# Altium schematic sheet amplifier.SchDoc: Class D Amplifier
size A2; Author: Harsha Sandirigama; DrawnBy: Harsha Sandirigama
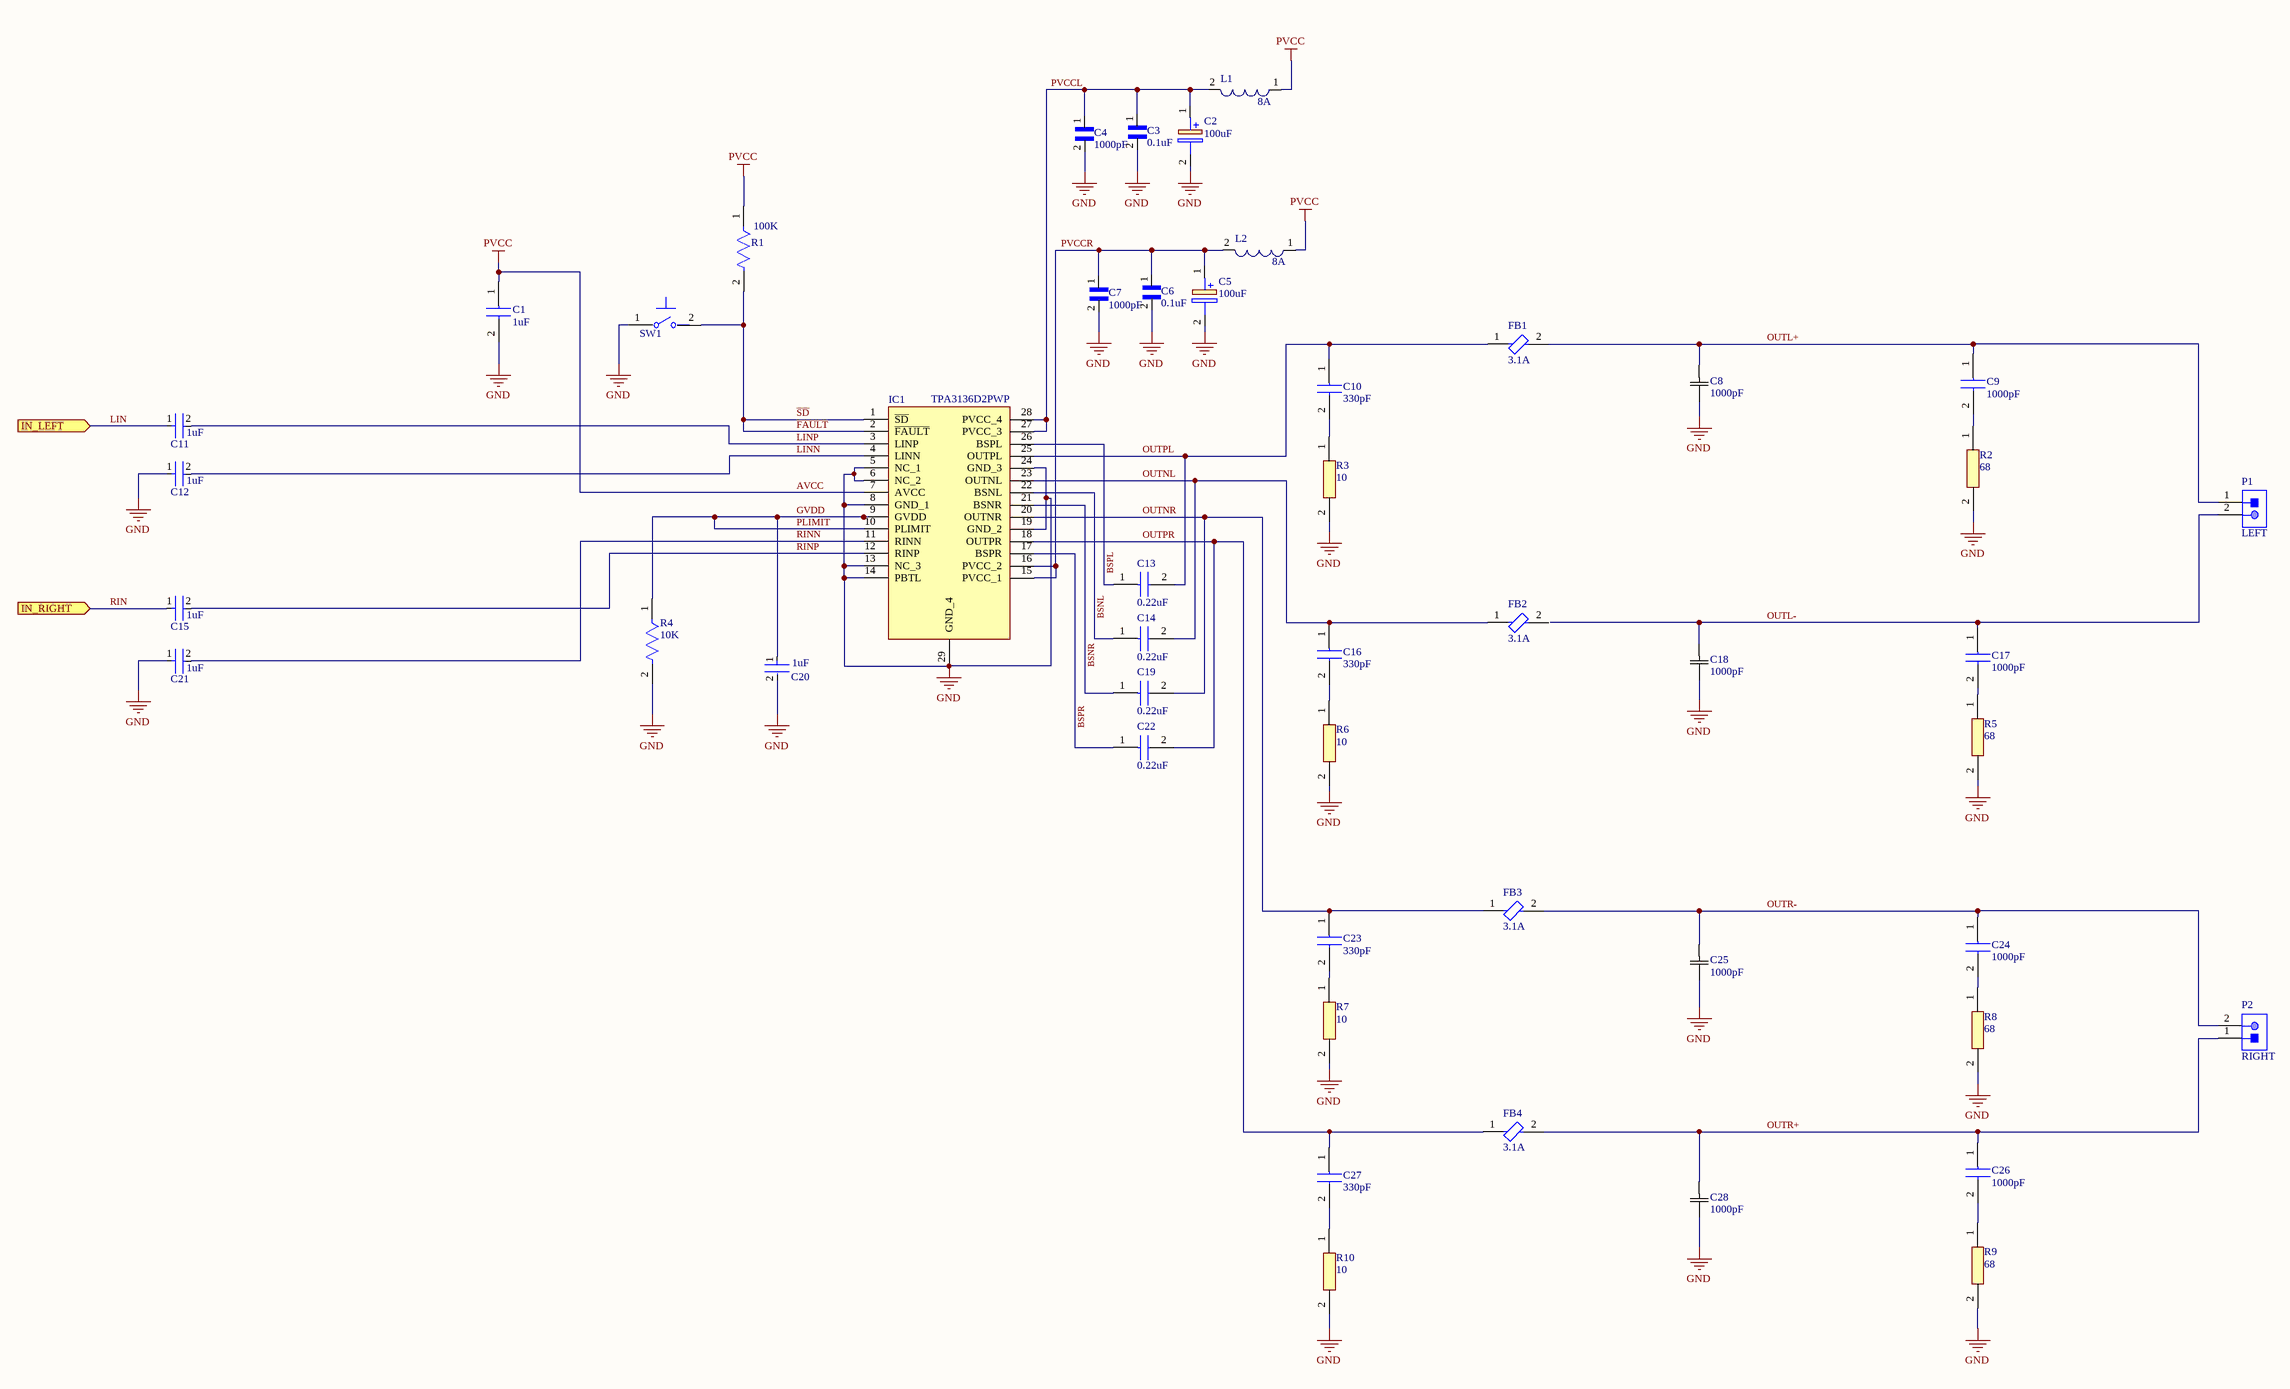
[diagram p0: amplifier.SchDoc]

## Parts
C1  1uF  [CAPC1608X90N]
C2  100uF  [CAPPRD350W60D825H1300]
C3  0.1uF  [CAPC1608X90N]
C4  1000pF  [CAPC1608X90N]
C5  100uF  [CAPPRD350W60D825H1300]
C6  0.1uF  [CAPC1608X90N]
C7  1000pF  [CAPC1608X90N]
C8  1000pF  [CAPC3216X94N]
C9  1000pF  [CAPC1608X90N]
C10  330pF  [CAPC1608X90N]
C11  1uF  [TDK_CGA3E-0_3-0_1_IPC_A]
C12  1uF  [TDK_CGA3E-0_3-0_1_IPC_A]
C13  0.22uF  [CAPC1608X90N]
C14  0.22uF  [CAPC1608X90N]
C15  1uF  [TDK_CGA3E-0_3-0_1_IPC_A]
C16  330pF  [CAPC1608X90N]
C17  1000pF  [CAPC1608X90N]
C18  1000pF  [CAPC3216X94N]
C19  0.22uF  [CAPC1608X90N]
C20  1uF  [TDK_CGA3E-0_3-0_1_IPC_A]
C21  1uF  [TDK_CGA3E-0_3-0_1_IPC_A]
C22  0.22uF  [CAPC1608X90N]
C23  330pF  [CAPC1608X90N]
C24  1000pF  [CAPC1608X90N]
C25  1000pF  [CAPC3216X94N]
C26  1000pF  [CAPC1608X90N]
C27  330pF  [CAPC1608X90N]
C28  1000pF  [CAPC3216X94N]
FB1  3.1A  [Murata_NFZ2MSD-d5_IPC_A]
FB2  3.1A  [Murata_NFZ2MSD-d5_IPC_A]
FB3  3.1A  [Murata_NFZ2MSD-d5_IPC_A]
FB4  3.1A  [Murata_NFZ2MSD-d5_IPC_A]
IC1  TPA3136D2PWP  [SOP65P640X120-29N]
L1  8A  [WE-MPSB-1812]
L2  8A  [WE-MPSB-1812]
P1  LEFT  [PHOE-1803277_V]
P2  RIGHT  [PHOE-1803277_V]
R1  100K  [TE_Connectivity_CPF0603_IPC_A]
R2  68  [RESC1608X55N - duplicate]
R3  10  [RESC1608X55N]
R4  10K  [Yageo_RT0603_IPC_A]
R5  68  [RESC1608X55N - duplicate]
R6  10  [RESC1608X55N]
R7  10  [RESC1608X55N]
R8  68  [RESC1608X55N - duplicate]
R9  68  [RESC1608X55N - duplicate]
R10  10  [RESC1608X55N]
SW1  TL1015AF160QG  [E-Switch_0_MFG]  (value not drawn)

## Ports
IN_LEFT (in), IN_RIGHT (in)

## Nets
AVCC: C1.1 IC1.7(AVCC) L1.1 L2.1 R1.1  [also labelled PVCC]
GND: C1.2 C2.2(-) C3.2 C4.2 C5.2(-) C6.2 C7.2 C8.2 C12.1 C18.2 C20.2 C21.1 C25.2 C28.2 IC1.5(NC_1) IC1.6(NC_2) IC1.8(GND_1) IC1.13(NC_3) IC1.14(PBTL) IC1.19(GND_2) IC1.24(GND_3) IC1.29(GND_4) R2.2 R3.2 R4.2 R5.2 R6.2 R7.2 R8.2 R9.2 R10.2 SW1.1
~{FAULT}: IC1.1(~{SD}) IC1.2(~{FAULT}) R1.2 SW1.2  [also labelled ~{SD}]
BSNL: C14.1 IC1.22(BSNL)
BSNR: C19.1 IC1.21(BSNR)
BSPL: C13.1 IC1.26(BSPL)
BSPR: C22.1 IC1.17(BSPR)
GVDD: C20.1 IC1.9(GVDD) IC1.10(PLIMIT) R4.1  [also labelled PLIMIT]
LIN: C11.1 ; port IN_LEFT
LINN: C12.2 IC1.4(LINN)
LINP: C11.2 IC1.3(LINP)
OUTL+: C8.1 C9.1 FB1.2 P1.1
OUTL-: C17.1 C18.1 P1.2
OUTNL: C14.2 C16.1 FB2.1 IC1.23(OUTNL)
OUTNR: C19.2 C23.1 FB3.1 IC1.20(OUTNR)
OUTPL: C10.1 C13.2 FB1.1 IC1.25(OUTPL)
OUTPR: C22.2 C27.1 FB4.1 IC1.18(OUTPR)
OUTR+: C26.1 C28.1 FB4.2 P2.1
OUTR-: C24.1 C25.1 FB3.2 P2.2
PVCCL: C2.1(+) C3.1 C4.1 IC1.27(PVCC_3) IC1.28(PVCC_4) L1.2
PVCCR: C5.1(+) C6.1 C7.1 IC1.15(PVCC_1) IC1.16(PVCC_2) L2.2
RIN: C15.1 ; port IN_RIGHT
RINN: C21.2 IC1.11(RINN)
RINP: C15.2 IC1.12(RINP)
NetC9_2: C9.2 R2.1
NetC10_2: C10.2 R3.1
NetC16_2: C16.2 R6.1
NetC17_2: C17.2 R5.1
NetC23_2: C23.2 R7.1
NetC24_2: C24.2 R8.1
NetC26_2: C26.2 R9.1
NetC27_2: C27.2 R10.1

Not connected (* = marked no-connect by the designer): FB2 2

## Library data of the parts
C1 = GMK107BJ105KA-T: CAP CER 1UF 35V X5R 0603; Manufacturer_Name: TAIYO YUDEN; Datasheet Link: http://ds.yuden.co.jp/TYCOMPAS/ut/detail.do?productNo=GMK107BJ105KA-T&fileName=GMK107BJ105KA-T_SS&mode=specSheetDownload; Height: 0.9mm; Manufacturer_Part_Number: GMK107BJ105KA-T; Mouser Part Number: 963-GMK107BJ105KA-T; Mouser Price/Stock: https://www.mouser.co.uk/ProductDetail/Taiyo-Yuden/GMK107BJ105KA-T?qs=I6KAKw0tg2ykHAqS8PSP9Q%3D%3D; Supplier 1: Digi-Key; Supplier Part Number 1: 587-1437-1-ND
C2 C5 = UHE1H101MPD: CAP ALUM 100UF 20% 50V RADIAL; Manufacturer_Name: Nichicon; Datasheet Link: https://www.mouser.com/datasheet/2/293/e-uhe-1220676.pdf; Height: 13mm; Manufacturer_Part_Number: UHE1H101MPD; Mouser Part Number: 647-UHE1H101MPD; Mouser Price/Stock: https://www.mouser.co.uk/ProductDetail/Nichicon/UHE1H101MPD?qs=oOyQ8mbwhO6kNSFA%252BBINjg%3D%3D; Arrow Part Number: UHE1H101MPD; Arrow Price/Stock: https://www.arrow.com/en/products/uhe1h101mpd/nichicon; Supplier 1: Digi-Key; Supplier Part Number 1: 493-1605-ND
C3 C6 = CL10B104KB8NNNL: CAP CER 0.1UF 50V X7R 0603; MF: Samsung Electro-Mechanics; MP: CL10B104KB8NNNL; SnapEDA_Link: https://www.snapeda.com/parts/CL10B104KB8NNNL/Samsung%20Electro-Mechanics/view-part/3598555/?ref=snap; Availability: Unavailable; Package: 0603 Samsung; Value: *; Price: None; Supplier 1: Digi-Key; Supplier 2: Digi-Key; Supplier 3: Digi-Key; Supplier 4: Arrow Electronics; Supplier Part Number 1: 1276-CL10B104KB8NNNLCT-ND; Supplier Part Number 2: 1276-CL10B104KB8NNNLDKR-ND; Supplier Part Number 3: 1276-CL10B104KB8NNNLTR-ND; Supplier Part Number 4: CL10B104KB8NNNL
C4 C7 = 06035A102JAT2A: 1000pF ±5% 50V Ceramic Capacitor C0G, NP0 0603 (1608 Metric); Package: None; Price: None; Value: *; MP: 06035A102JAT2A; Availability: Unavailable; Supplier 1: Digi-Key; Supplier 2: Digi-Key; Supplier 3: Digi-Key; Supplier 4: Newark; Supplier Part Number 3: 478-1187-2-ND; Supplier Part Number 4: 92C3552; Supplier Part Number 2: 478-1187-6-ND; Supplier Part Number 1: 478-1187-1-ND
C8 C18 C25 C28 = 12061C102KAT2A: CAP CER 1000PF 100V X7R 1206; Vendor: AVX Corporation; Built_By: EMA_UL_Team; SourceLibrary: AVX_2015-1-12; Type: DEV; Manufacturer_Part_Number: 12061C102KAT2A; Copyright: Copyright (C) 2018 Accelerated Designs. All rights reserved; RefDes: RefDes; Supplier 1: Digi-Key; Supplier Part Number 1: 478-1517-1-ND
C9 C17 C24 C26 = 06035A102KAT2A: CAP CER 1000PF 50V C0G/NP0 0603; Manufacturer_Name: AVX; Datasheet Link: http://www.mouser.com/catalog/supplier/library/pdf/AVXSurfaceMountCeramic.pdf; Height: 0.9mm; Manufacturer_Part_Number: 06035A102KAT2A; Mouser Part Number: 581-06035A102KAT2A; Mouser Price/Stock: https://www.mouser.co.uk/ProductDetail/AVX/06035A102KAT2A/?qs=I5rfTV0A4wH27QeFGHRn6w%3D%3D; Arrow Part Number: 06035A102KAT2A; Arrow Price/Stock: https://www.arrow.com/en/products/06035a102kat2a/avx; Supplier 1: Digi-Key; Supplier Part Number 1: 478-3718-1-ND
C10 C16 C23 C27 = 06035A331JAT2A: CAP CER 330PF 50V C0G/NP0 0603; Manufacturer_Name: AVX; Datasheet Link: http://datasheets.avx.com/C0GNP0-Dielectric.pdf; Height: 0.9mm; Manufacturer_Part_Number: 06035A331JAT2A; Mouser Part Number: 581-06035A331J; Mouser Price/Stock: https://www.mouser.co.uk/ProductDetail/AVX/06035A331JAT2A?qs=nHLfGqofz%252BCe6DSmi7JEiw%3D%3D; Supplier 1: Digi-Key; Supplier Part Number 1: 478-1181-1-ND
C11 C12 C15 C20 C21 = CGA3E1X7R1C105K080AC: 1µF ±10% 16V Ceramic Capacitor X7R 0603 (1608 Metric); Supplier 1: Digi-Key; Supplier 2: Digi-Key; Supplier 3: Digi-Key; Supplier 4: Newark; Supplier 5: Future Electronics; Supplier Part Number 1: 445-12539-1-ND; Supplier Part Number 2: 445-12539-6-ND; Supplier Part Number 3: 445-12539-2-ND; Supplier Part Number 4: 78Y9849; Supplier Part Number 5: 9066947
C13 C14 C19 C22 = 06033D224KAT2A: CAP CER 0.22UF 25V X5R 0603; Manufacturer_Name: AVX; Datasheet Link: http://docs-emea.rs-online.com/webdocs/0def/0900766b80def1a5.pdf; Height: 0.9mm; Manufacturer_Part_Number: 06033D224KAT2A; Mouser Part Number: 581-06033D224K; Mouser Price/Stock: https://www.mouser.co.uk/ProductDetail/AVX/06033D224KAT2A/?qs=yuhjMS%2FIYxbJrex57OiWTw%3D%3D; Arrow Part Number: 06033D224KAT2A; Arrow Price/Stock: https://www.arrow.com/en/products/06033d224kat2a/avx; Supplier 1: Digi-Key; Supplier 2: Digi-Key; Supplier Part Number 1: 478-1245-1-ND; Supplier Part Number 2: 478-1245-6-ND
FB1-FB4 = NFZ2MSD301SZ10L: 300 Ohms @ 100MHz 1  Ferrite Bead 0806 (2016 Metric) 3.8A 26mOhm; Supplier 1: Digi-Key; Supplier 2: Mouser; Supplier Part Number 2: 81-NFZ2MSD301SZ10L; Supplier Part Number 1: 490-NFZ2MSD301SZ10LCT-ND
IC1 = TPA3136D2PWP: IC AMP CLASS D STER 10W 28HTSSOP; Manufacturer_Name: Texas Instruments; Datasheet Link: http://www.ti.com/lit/ds/symlink/tpa3136d2.pdf; Height: 1.2mm; Manufacturer_Part_Number: TPA3136D2PWP; Mouser Part Number: 595-TPA3136D2PWP; Mouser Price/Stock: https://www.mouser.com/Search/Refine.aspx?Keyword=595-TPA3136D2PWP; Arrow Part Number: TPA3136D2PWP; Arrow Price/Stock: https://www.arrow.com/en/products/tpa3136d2pwp/texas-instruments; Supplier 1: Digi-Key; Supplier Part Number 1: TPA3136D2PWP-ND
L1 L2 = 74279226101: 100 Ohms @ 100MHz 1  Ferrite Bead 1812 (4532 Metric) 8A 6mOhm; Manufacturer: Wuerth Elektronik; Impedance: 100 Ohm; ComponentLink1Description: Manufacturer URL; ComponentLink2Description: Datasheet; ComponentLink1URL: http://www.we-online.com; PartNumber: 74279226101; ComponentLink2URL: http://katalog.we-online.com/pbs/datasheet/74279226101.pdf; PackageReference: WE-MPSB-1812; Supplier 1: Digi-Key; Supplier 2: Digi-Key; Supplier 3: Newark; Supplier 4: Mouser; Supplier 5: RSComponents; Supplier Part Number 1: 732-3431-1-ND; Supplier Part Number 2: 732-3431-6-ND; Supplier Part Number 3: 74T0824; Supplier Part Number 4: 710-74279226101; Supplier Part Number 5: 7498328
P1 P2 = 1803277: 2 Position Terminal Block Header, Male Pins, Shrouded (4 Side) 0.150" (3.81mm) 90°, Right Angle  Through Hole; Tolerance: 5%; Elements: 4; Voltage Rating: 50 V; Case\Package: 1205; Resistance: 10 kohm; Power Rating: 248 mW; RoHSCompliant: true; Min Operating Temperature: -55 degC; Case Code (Imperial): 1206; Width: 0.063 inch; Pins: 8; ComponentLink1Description: Manufacturer URL; ComponentLink2Description: Datasheet; DatasheetVersion: Feb-14; ComponentLink3URL: https://www.phoenixcontact.com/online/portal/us/pxc/product_detail_page/!ut/p/b1/3ZfJkqM4EIafpR6AQmA2H9n3fTNcCLbCgDGrDfjpp6pmYg4T012XDh-MLkihiC__TGUqBcdwBKEIwNDDAScAfILja3qvq3Sp-2t6-ZrHROIxHs9bKIGYNs4AmcNZXsMcRDJQOIRPAEvchpoUjx1UTZ38Zl8Xbz54zDr6CpsNzjayIR3; ComponentLink1URL: http://www.phoenixcontact.com/; ComponentLink2URL: https://datasheet.ciiva.com/16096/1803277-16096845.pdf; PackageReference: 1803277; ComponentLink3Description: Package Specification; Mount: Surface Mount; Length: 0.126 inch; REACH SVHC: No SVHC; Radiation Hardening: No; Max Operating Temperature: 125 degC; Package Quantity: 1; Height: 0.024 inch; Packaging: Cut Tape; PackageDescription: Male Header, Pitch 3.81 mm, 1 x 2 Position, Height 7.25 mm, Tail Length 3.4 mm; Case Code (Metric): 3216; PartNumber: 1803277; Supplier 1: Digi-Key; Supplier 2: Newark; Supplier 3: Allied Electronics; Supplier 4: Mouser; Supplier 5: Arrow Electronics; Supplier Part Number 1: 277-1206-ND; Supplier Part Number 2: 80R8083; Supplier Part Number 3: 70054540; Supplier Part Number 4: 651-1803277; Supplier Part Number 5: 1803277
R1 = CPF0603F100KC1: 100 kOhms ±1% 0.063W, 1/16W Chip Resistor 0603 (1608 Metric)  Thin Film; Supplier 1: Digi-Key; Supplier 2: Digi-Key; Supplier 3: Newark; Supplier 4: Newark; Supplier 5: Newark; Supplier 6: Arrow Electronics; Supplier 7: Future Electronics; Supplier Part Number 1: A102199CT-ND; Supplier Part Number 2: A102199DKR-ND; Supplier Part Number 3: 36AC5509; Supplier Part Number 4: 76AH1709; Supplier Part Number 5: 73M9673; Supplier Part Number 6: CPF0603F100KC1; Supplier Part Number 7: 9093920
R2 R5 R8 R9 = RC0603JR-0768RL: RES SMD 68 OHM 5% 1/10W 0603; Manufacturer_Name: YAGEO (PHYCOMP); Datasheet Link: http://www.yageo.com/documents/recent/PYu-RC0603_51_RoHS_L_v5.pdf; Height: 0.55mm; Manufacturer_Part_Number: RC0603JR-0768RL; Mouser Part Number: 603-RC0603JR-0768RL; Mouser Price/Stock: https://www.mouser.com/Search/Refine.aspx?Keyword=603-RC0603JR-0768RL; Arrow Part Number: RC0603JR-0768RL; Arrow Price/Stock: https://www.arrow.com/en/products/rc0603jr-0768rl/yageo; Supplier 1: Digi-Key; Supplier 2: Digi-Key; Supplier Part Number 1: 311-68GRCT-ND; Supplier Part Number 2: 311-68GRDKR-ND
R3 R6 R7 R10 = ESR03EZPF10R0: RES SMD 10 OHM 1% 1/4W 0603; Manufacturer_Name: ROHM Semiconductor; Datasheet Link: https://componentsearchengine.com/Datasheets/2/ESR03EZPF10R0.pdf; Height: 0.55mm; Manufacturer_Part_Number: ESR03EZPF10R0; Mouser Part Number: 755-ESR03EZPF10R0; Mouser Price/Stock: https://www.mouser.co.uk/ProductDetail/ROHM-Semiconductor/ESR03EZPF10R0?qs=DyUWGjl%252BcVsZb0vCjbe8PA%3D%3D; Supplier 1: Digi-Key; Supplier Part Number 1: RHM10.0ADCT-ND
R4 = RT0603BRB0710KL: RES SMD 10K OHM 0.1% 1/10W 0603; Supplier 1: Digi-Key; Supplier 2: Digi-Key; Supplier 3: Digi-Key; Supplier 4: Arrow Electronics; Supplier Part Number 1: YAG4438CT-ND; Supplier Part Number 2: YAG4438DKR-ND; Supplier Part Number 3: YAG4438TR-ND; Supplier Part Number 4: RT0603BRB0710KL
SW1 = TL1015AF160QG: SWITCH TACTILE SPST-NO 0.05A 12V; Supplier 1: Digi-Key; Supplier 2: Digi-Key; Supplier 3: Mouser; Supplier Part Number 1: EG4344CT-ND; Supplier Part Number 2: EG4344DKR-ND; Supplier Part Number 3: 612-TL1015AF